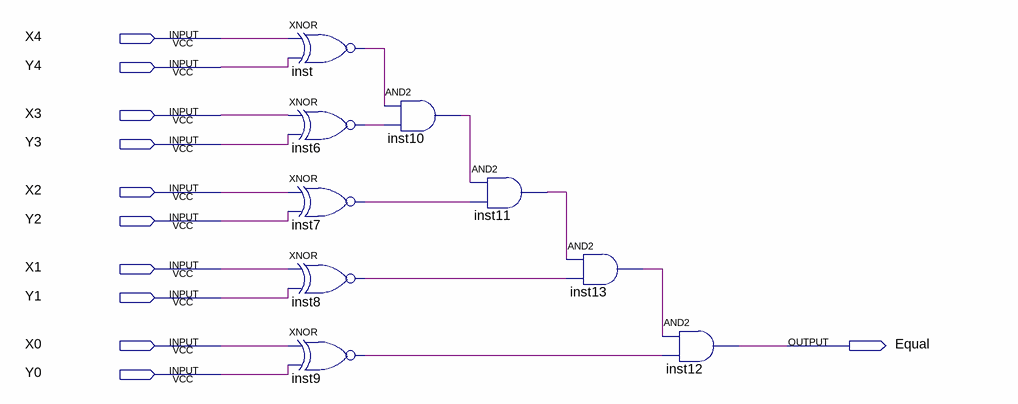
[diagram p0: schematic sheet]
// Quartus schematic Equal.bdf as structural Verilog: 9 symbols, 11 pins
module Equal (
  input  X4,
  input  Y4,
  input  X3,
  input  Y3,
  input  X2,
  input  Y2,
  input  X1,
  input  Y1,
  input  X0,
  input  Y0,
  output Equal
);

  wire inst6_out, inst7_out, inst8_out, inst9_out, inst10_out, inst11_out, inst13_out, inst_out;

  xnor inst (inst_out, X4, Y4);
  xnor inst6 (inst6_out, X3, Y3);
  xnor inst7 (inst7_out, X2, Y2);
  xnor inst8 (inst8_out, X1, Y1);
  xnor inst9 (inst9_out, X0, Y0);
  and inst10 (inst10_out, inst_out, inst6_out);
  and inst11 (inst11_out, inst10_out, inst7_out);
  and inst13 (inst13_out, inst11_out, inst8_out);
  and inst12 (Equal, inst13_out, inst9_out);
endmodule
